# Altium schematic sheet Sheet_1_2022-06-06.schdoc
size 321 x 213 mm
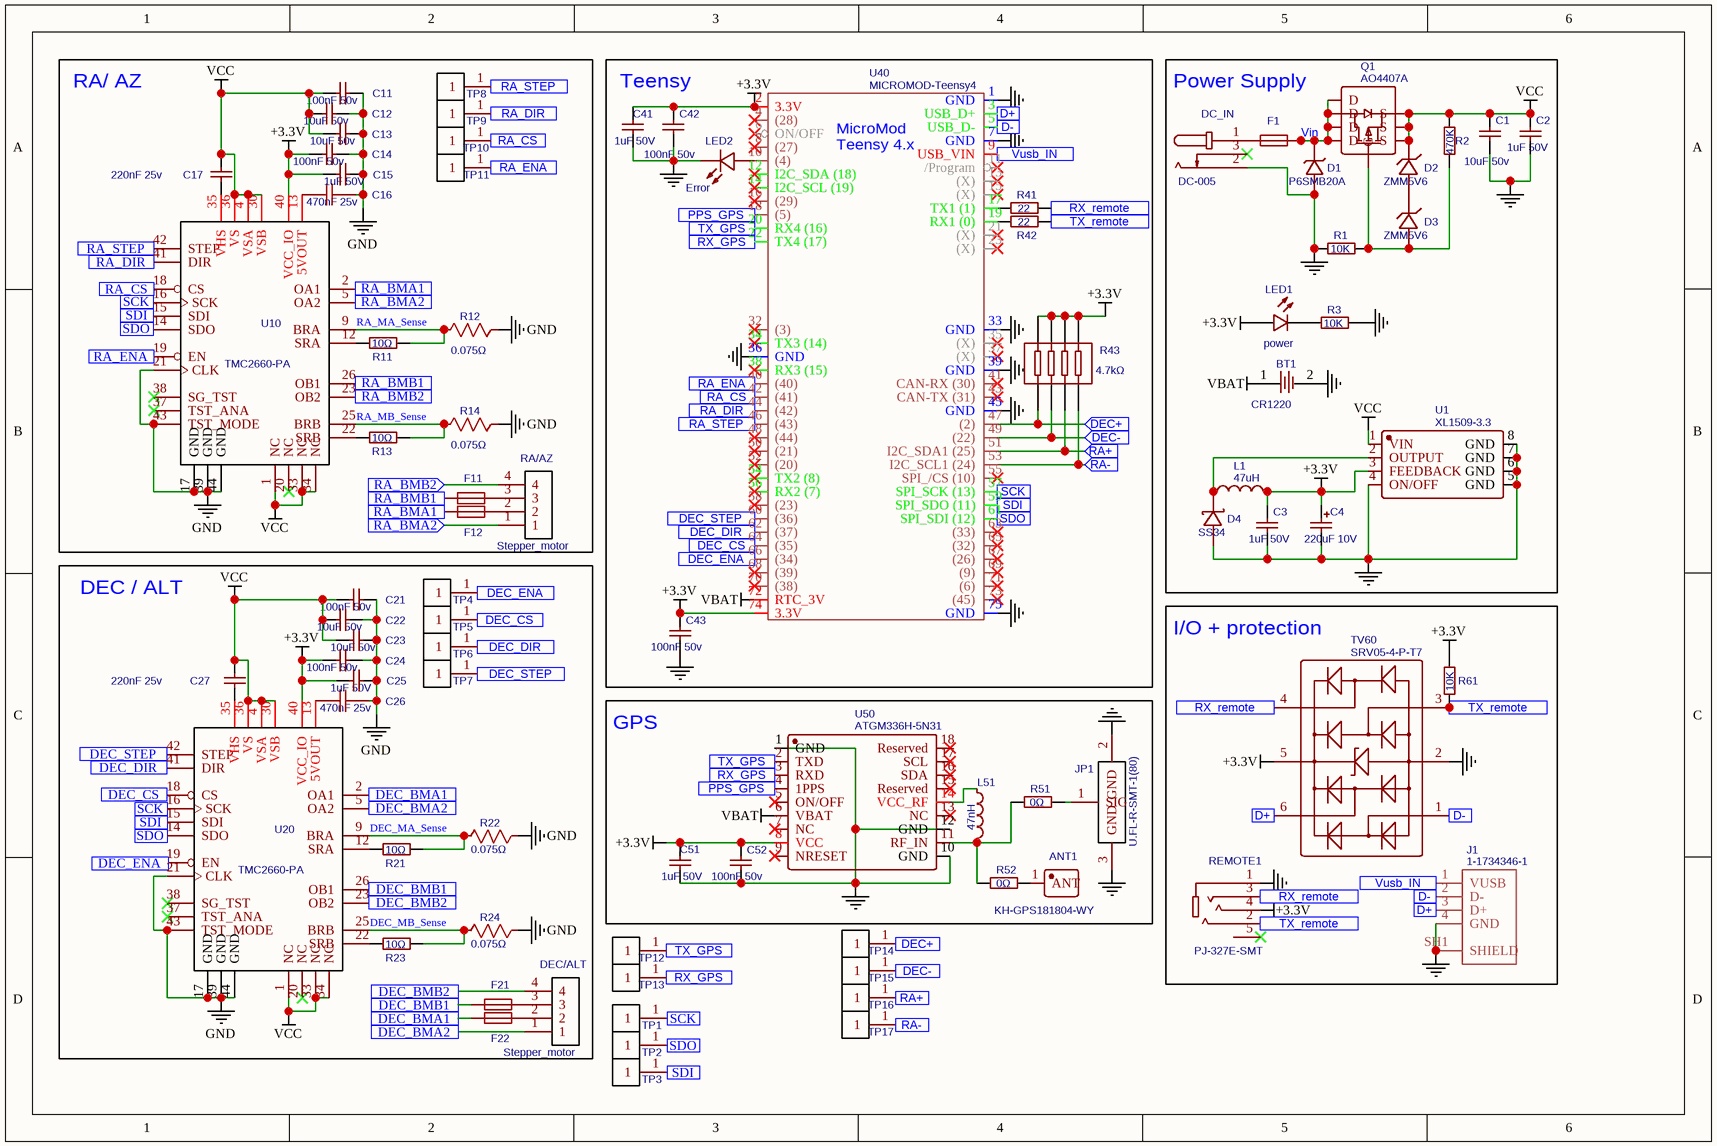
[diagram p0: Sheet_1_2022-06-06.schdoc]

## Parts
ANT1  KH-GPS181804-WY  [GPS-ANT-TH_L18.0-W18.0]
BT1  CR1220  [BAT-SMD_CR1220-2ZX]
C1  10uF 50v  [C1206]
C2  1uF 50V  [C_0603]
C3  1uF 50V  [C_0603]
C4  220uF 10V  [CAP-SMD_L7.3-W4.3-R-RD]
C11  100nF 50v  [C_0603]
C12  10uF 50v  [C1206]
C13  10uF 50v  [C1206]
C14  100nF 50v  [C_0603]
C15  1uF 50V  [C_0603]
C16  470nF 25v  [C_0603]
C17  220nF 25v  [C_0603]
C21  100nF 50v  [C_0603]
C22  10uF 50v  [C1206]
C23  10uF 50v  [C1206]
C24  100nF 50v  [C_0603]
C25  1uF 50V  [C_0603]
C26  470nF 25v  [C_0603]
C27  220nF 25v  [C_0603]
C41  1uF 50V  [C_0603]
C42  100nF 50v  [C_0603]
C43  100nF 50v  [C_0603]
C51  1uF 50V  [C_0603]
C52  100nF 50v  [C_0603]
D1  P6SMB20A  [DO-214AA_L5.6-W4.0-RD]
D2  ZMM5V6  [LL-34_L3.5-W1.5-RD]
D3  ZMM5V6  [LL-34_L3.5-W1.5-RD]
D4  SS34  [DO-214AC_L4.3-W2.7-LS5.3-RD]
DC_IN  DC-005  [DC-IN-TH_DC-005-5A-2.0-SMT]
DEC/ALT  Stepper_motor  [STEPPER_MOTOR_VERT]
F1  SMD1812P300SLR/24  [F1812]  (value not drawn)
F11  SMD1812P300SLR/24  [F1812]  (value not drawn)
F12  SMD1812P300SLR/24  [F1812]  (value not drawn)
F21  SMD1812P300SLR/24  [F1812]  (value not drawn)
F22  SMD1812P300SLR/24  [F1812]  (value not drawn)
J1  1-1734346-1  [TE_1-1734346-1]
JP1  U.FL-R-SMT-1(80)  [RF-SMD_734120114]
L1  47uH  [IND-SMD_L10.8-W10.0_SLO1040H]
L51  47nH  [L0603]
LED1  power  [LED0603-R-RD]
LED2  Error  [LED0603-R-RD]
Q1  AO4407A  [SOIC-8_L4.9-W3.9-P1.27-LS6.0-BL]
R1  10K  [R_0603]
R2  470K  [R_0603]
R3  10K  [R_0603]
R11  10Ω  [R0603]
R12  0.075Ω  [R2512]
R13  10Ω  [R0603]
R14  0.075Ω  [R2512]
R21  10Ω  [R0603]
R22  0.075Ω  [R2512]
R23  10Ω  [R0603]
R24  0.075Ω  [R2512]
R41  22  [R_0603]
R42  22  [R_0603]
R43  4.7kΩ  [RES-ARRAY-SMD_0603-8P-L3.2-W1.6-BL]
R51  0Ω  [R0603]
R52  0Ω  [R0603]
R61  10K  [R_0603]
RA/AZ  Stepper_motor  [STEPPER_MOTOR_VERT]
REMOTE1  PJ-327E-SMT  [AUDIO-SMD_PJ-327E-SMT]
TP1  test_point  [TEST_POINT]  (value not drawn)
TP2  test_point  [TEST_POINT]  (value not drawn)
TP3  test_point  [TEST_POINT]  (value not drawn)
TP4  test_point  [TEST_POINT]  (value not drawn)
TP5  test_point  [TEST_POINT]  (value not drawn)
TP6  test_point  [TEST_POINT]  (value not drawn)
TP7  test_point  [TEST_POINT]  (value not drawn)
TP8  test_point  [TEST_POINT]  (value not drawn)
TP9  test_point  [TEST_POINT]  (value not drawn)
TP10  test_point  [TEST_POINT]  (value not drawn)
TP11  test_point  [TEST_POINT]  (value not drawn)
TP12  test_point  [TEST_POINT]  (value not drawn)
TP13  test_point  [TEST_POINT]  (value not drawn)
TP14  test_point  [TEST_POINT]  (value not drawn)
TP15  test_point  [TEST_POINT]  (value not drawn)
TP16  test_point  [TEST_POINT]  (value not drawn)
TP17  test_point  [TEST_POINT]  (value not drawn)
TV60  SRV05-4-P-T7  [SOT-23-6_L2.9-W1.6-P0.95-LS2.8-BR]
U1  XL1509-3.3  [SOIC-8_L4.9-W3.9-P1.27-LS6.0-BL]
U10  TMC2660-PA  [PQFP44_WITH_PADS]
U20  TMC2660-PA  [PQFP44_WITH_PADS]
U40  MICROMOD-Teensy4  [M.2-CONNECTOR-E]
U50  ATGM336H-5N31  [GPSM-SMD_ATGM336H-TR]

## Blocks framed on the sheet
RA/ AZ: C11-C17 F11 F12 R11-R14 RA/AZ TP8-TP11 U10
Teensy: C41-C43 LED2 R41-R43 U40
Power Supply: BT1 C1-C4 D1-D4 DC_IN F1 L1 LED1 Q1 R1-R3 U1
DEC / ALT: C21-C27 DEC/ALT F21 F22 R21-R24 TP4-TP7 U20
I/O + protection: J1 R61 REMOTE1 TV60
GPS: ANT1 C51 C52 JP1 L51 R51 R52 U50

## Ports
D+ (in), D- (in), DEC+ (in), DEC- (in), DEC_BMA1 (in), DEC_BMA2 (in), DEC_BMB1 (in), DEC_BMB2 (in), DEC_CS (in), DEC_DIR (in), DEC_ENA (in), DEC_STEP (in), PPS_GPS (in), RA+ (in), RA- (in), RA_BMA1 (in), RA_BMA2 (in), RA_BMB1 (in), RA_BMB2 (in), RA_CS (in), RA_DIR (in), RA_ENA (in), RA_STEP (in), RX_GPS (in), RX_remote (in), SCK (in), SDI (in), SDO (in), TX_GPS (in), TX_remote (in), Vusb_IN (in)

## Nets
+3.3V: C3.2 C4.1 C14.1 C15.2 C24.1 C25.2 C41.2 C42.1 C43.1 C51.2 C52.1 L1.2 LED1.1(A) R43.1 R43.2 R43.3 R43.4 R61.1 REMOTE1.4 TV60.5 U1.3(FEEDBACK) U10.40(VCC_IO) U20.40(VCC_IO) U40.2(3.3V) U40.74(3.3V) U50.8(VCC)
GND: BT1.2 C1.2 C2.1 C3.1 C4.2 C11.1 C12.1 C13.1 C14.2 C15.1 C16.2 C21.1 C22.1 C23.1 C24.2 C25.1 C26.2 C41.1 C42.2 C43.2 C51.1 C52.2 D1.2 D4.2(A) DC_IN.2 J1.4(GND) J1.SH1(SHIELD) J1.SH2(SHIELD) JP1.2(GND) JP1.3(GND) LED2.2(K) R1.1 R3.1 R12.1 R14.1 R22.1 R24.1 REMOTE1.1 TV60.2 U1.4(ON/OFF) U1.5(GND) U1.6(GND) U1.7(GND) U1.8(GND) U10.17(GND) U10.21(CLK) U10.39(GND) U10.43(TST_MODE) U10.44(GND) U20.17(GND) U20.21(CLK) U20.39(GND) U20.43(TST_MODE) U20.44(GND) U40.1(GND) U40.7(GND) U40.33(GND) U40.36(GND) U40.39(GND) U40.45(GND) U40.75(GND) U50.1(GND) U50.10(GND) U50.12(GND)
VBAT: BT1.1 U40.72(RTC_3V) U50.6(VBAT)
VCC: C1.1 C2.2 C11.2 C12.2 C13.2 C17.2 C21.2 C22.2 C23.2 C27.2 D2.1(C) Q1.1(S) Q1.2(S) Q1.3(S) R2.2 U1.1(VIN) U10.1(NC) U10.4(VSA) U10.30(VSB) U10.33(NC) U10.34(NC) U10.36(VS) U20.1(NC) U20.4(VSA) U20.30(VSB) U20.33(NC) U20.34(NC) U20.36(VS)
D+: J1.3(D+) TV60.6 U40.3(USB_D+) ; port D+
D-: J1.2(D-) TV60.1 U40.5(USB_D-) ; port D-
DEC+: R43.5 TP14.1 U40.47((2)) ; port DEC+
DEC-: R43.6 TP15.1 U40.49((22)) ; port DEC-
DEC_CS: TP5.1 U40.64((35)) ; port DEC_CS
DEC_DIR: TP6.1 U40.62((37)) ; port DEC_DIR
DEC_ENA: TP4.1 U40.66((34)) ; port DEC_ENA
DEC_MA_Sense: R21.2 R22.2 U20.9(BRA)
DEC_MB_Sense: R23.2 R24.2 U20.25(BRB)
DEC_STEP: TP7.1 U40.60((36)) ; port DEC_STEP
PPS_GPS: U40.18((5)) U50.4(1PPS) ; port PPS_GPS
RA+: R43.7 TP16.1 U40.51(I2C_SDA1_(25)) ; port RA+
RA-: R43.8 TP17.1 U40.53(I2C_SCL1_(24)) ; port RA-
RA_BMA1: F12.1 ; port RA_BMA1
RA_BMA2: RA/AZ.1 ; port RA_BMA2
RA_BMB1: F11.1 ; port RA_BMB1
RA_BMB2: RA/AZ.4 ; port RA_BMB2
RA_CS: TP10.1 U10.18(CS) U40.42((41)) ; port RA_CS
RA_DIR: TP9.1 U10.41(DIR) U40.44((42)) ; port RA_DIR
RA_ENA: TP11.1 U10.19(EN) U40.40((40)) ; port RA_ENA
RA_MA_Sense: R11.2 R12.2 U10.9(BRA)
RA_MB_Sense: R13.2 R14.2 U10.25(BRB)
RA_STEP: TP8.1 U10.42(STEP) U40.46((43)) ; port RA_STEP
RX_GPS: TP13.1 U40.22(TX4_(17)) U50.3(RXD) ; port RX_GPS
RX_remote: R41.1 REMOTE1.3 TV60.4 ; port RX_remote
SCK: U20.16(SCK) U40.57(SPI_SCK_(13)) ; port SCK
SDI: U20.15(SDI) U40.59(SPI_SDO_(11)) ; port SDI
SDO: U20.14(SDO) U40.61(SPI_SDI_(12)) ; port SDO
TX_GPS: TP12.1 U40.20(RX4_(16)) U50.2(TXD) ; port TX_GPS
TX_remote: R42.1 R61.2 REMOTE1.2 TV60.3 ; port TX_remote
Vin: D1.1 F1.1 Q1.5(D) Q1.6(D) Q1.7(D) Q1.8(D)
Vusb_IN: J1.1(VUSB) U40.9(USB_VIN) ; port Vusb_IN
NetANT1_1: ANT1.1(ANT) R52.1
NetC16_1: C16.1 U10.13(5VOUT)
NetC17_1: C17.1 U10.35(VHS)
NetC26_1: C26.1 U20.13(5VOUT)
NetC27_1: C27.1 U20.35(VHS)
NetD2_2: D2.2(A) D3.1(C)
NetD3_2: D3.2(A) Q1.4(G) R1.2 R2.1
NetD4_1: D4.1(K) L1.1 U1.2(OUTPUT)
NetDC_IN_1: DC_IN.1 F1.2
NetDEC/ALT_2: DEC/ALT.2 F22.1
NetDEC/ALT_3: DEC/ALT.3 F21.1
NetF11_2: F11.2 RA/AZ.3
NetF12_2: F12.2 RA/AZ.2
NetJP1_1: JP1.1(SIG) R51.2
NetL51_1: L51.1 U50.14(VCC_RF)
NetL51_2: L51.2 R51.1 R52.2 U50.11(RF_IN)
NetLED1_2: LED1.2(C) R3.2
NetLED2_1: LED2.1(A) U40.10((4))
NetR11_1: R11.1 U10.12(SRA)
NetR13_1: R13.1 U10.22(SRB)
NetR21_1: R21.1 U20.12(SRA)
NetR23_1: R23.1 U20.22(SRB)
NetR41_2: R41.2 U40.17(TX1_(1))
NetR42_2: R42.2 U40.19(RX1_(0))

Not connected (* = marked no-connect by the designer): DC_IN 3*; DEC/ALT 1 4; F21 2; F22 2; REMOTE1 5*; TP1 1; TP2 1; TP3 1; U10 2(OA1) 5(OA2) 14(SDO) 15(SDI) 16(SCK) 20(NC)* 23(OB2) 26(OB1) 37(TST_ANA)* 38(SG_TST)*; U20 2(OA1) 5(OA2) 18(CS) 19(EN) 20(NC)* 23(OB2) 26(OB1) 37(TST_ANA)* 38(SG_TST)* 41(DIR) 42(STEP); U40 4((28))* 6(ON/OFF)* 8((27))* 11(/Program)* 12(I2C_SDA_(18))* 13((X))* 14(I2C_SCL_(19))* 15((X))* 16((29))* 21((X))* 23((X))* 32((3))* 34(TX3_(14))* 35((X))* 37((X))* 38(RX3_(15))* 41(CAN-RX_(30))* 43(CAN-TX_(31))* 48((44))* 50((21))* 52((20))* 54(TX2_(8))* 55(SPI_/CS_(10))* 56(RX2_(7))* 58((23))* 63((33))* 65((32))* 67((26))* 68((39))* 69((9))* 70((38))* 71((6))* 73((45))*; U50 5(ON/OFF)* 7(NC)* 9(NRESET)* 13(NC)* 15(Reserved)* 16(SDA)* 17(SCL)* 18(Reserved)*

## Notes on the sheet
- (in symbol MICROMOD-Teensy4) MicroMod / Teensy 4.x

## Library data of the parts
ANT1 = KH-GPS181804-WY: BOM_Manufacturer: kinghelm(金航标); Contributor: LCSC; BOM_Supplier: LCSC; BOM_Supplier Part: C962215; BOM_Manufacturer Part: KH-GPS181804-WY; spicePre: L; spiceSymbolName: KH-GPS181804-WY
BT1 = CR1220: BOM_Manufacturer: Q&J; BOM_Manufacturer Part: CR1220-2; Contributor: LCSC; BOM_Supplier: LCSC; BOM_Supplier Part: C70381; BOM_JLCPCB Part Class: Extended Part; spicePre: B; spiceSymbolName: CR1220-2ZX
C1 C12 C13 C22 C23 = 10uF 50v: BOM_Manufacturer Part: CL31A106KBHNNNE; BOM_Manufacturer: SAMSUNG; nameAlias: Capacitance; SMT Type: Basic; BOM_Supplier: LCSC; BOM_LCSC Assembly: Yes; BOM_Supplier Part: C13585; spicePre: C; spiceSymbolName: CL31A106KBHNNNE
C2 C3 C15 C25 C41 C51 = 1uF 50V: BOM_Manufacturer Part: CL10A105KB8NNNC; BOM_Manufacturer: SAMSUNG; nameAlias: Capacitance; SMT Type: Basic; BOM_Supplier: LCSC; BOM_LCSC Assembly: Yes; BOM_Supplier Part: C15849; spicePre: C; spiceSymbolName: CL10A105KB8NNNC
C4 = 220uF 10V: BOM_Manufacturer: AVX; BOM_Manufacturer Part: TAJD227K010RNJ; nameAlias: Capacitance; BOM_Supplier: LCSC; BOM_Supplier Part: C8024; BOM_JLCPCB Part Class: Extended Part; spicePre: C; spiceSymbolName: TAJD227K010RNJ
C11 C14 C21 C24 C42 C43 C52 = 100nF 50v: BOM_Manufacturer Part: CC0603KRX7R9BB104; BOM_Manufacturer: YAGEO; nameAlias: Capacitance; SMT Type: Extend; BOM_Supplier: LCSC; BOM_Supplier Part: C14663; BOM_LCSC Assembly: Yes; spicePre: C; spiceSymbolName: CL10B104JB8NNNC
C16 C26 = 470nF 25v: BOM_Manufacturer: SAMSUNG; BOM_Manufacturer Part: CL10B474KA8NNNC; nameAlias: Capacitance; Contributor: LCSC; SMT Type: Extend; BOM_Supplier: LCSC; BOM_Supplier Part: C1623; BOM_LCSC Assembly: Yes; spicePre: C; spiceSymbolName: CL10A474KB8NNNC
C17 C27 = 220nF 25v: BOM_Manufacturer Part: CL10B224KA8NNNC; BOM_Manufacturer: SAMSUNG; nameAlias: Capacitance; SMT Type: Basic; BOM_Supplier: LCSC; BOM_LCSC Assembly: Yes; BOM_Supplier Part: C21120; spicePre: C; spiceSymbolName: CL10B224KA8NNNC
D1 = P6SMB20A: BOM_Manufacturer: Yint; Contributor: LCSC; BOM_Supplier: LCSC; BOM_Supplier Part: C719321; BOM_Manufacturer Part: P6SMB20A; BOM_JLCPCB Part Class: Extended Part; spicePre: D; spiceSymbolName: P6SMB20A_C719321
D2 D3 = ZMM5V6: BOM_Manufacturer: SEMTECH; SMT Type: Basic; BOM_Supplier: LCSC; BOM_Manufacturer Part: ZMM5V6; BOM_LCSC Assembly: Yes; image: //image.lceda.cn/szlcsc/C8062.jpg; BOM_Supplier Part: C8062; spicePre: D; spiceSymbolName: ZMM5V6
D4 = SS34: BOM_Manufacturer: MDD; BOM_Supplier: LCSC; BOM_Manufacturer Part: SS34; BOM_Supplier Part: C8678; BOM_JLCPCB Part Class: Basic Part; spicePre: D; spiceSymbolName: SS34_C8678
DC_IN = DC-005: BOM_Manufacturer: XKB Enterprise; BOM_Manufacturer Part: DC-005-5A-2.0-SMT; Contributor: LCSC; BOM_Supplier: LCSC; BOM_Supplier Part: C319134; BOM_JLCPCB Part Class: Extended Part; spicePre: D; spiceSymbolName: DC-005-5A-2.0-SMT
DEC/ALT RA/AZ = Stepper_motor: BOM_Manufacturer Part: 1x4 pin header; Contributor: Ti nicO Lord Zurp; spicePre: U; spiceSymbolName: Stepper_motor
F1 F11 F12 F21 F22 = SMD1812P300SLR/24: BOM_Manufacturer: PTTC(聚鼎); SMT Type: Extend; Contributor: LCSC; BOM_Supplier: LCSC; BOM_Supplier Part: C2892380; BOM_Manufacturer Part: SMD1812P300SLR/24; BOM_LCSC Assembly: Yes; spicePre: F; spiceSymbolName: SMD1812P300SLR/24
J1 = 1-1734346-1: Contributor: eriquelmev; spicePre: J; spiceSymbolName: 1-1734346-1
JP1 = U.FL-R-SMT-1(80): BOM_Manufacturer: HRS; BOM_Supplier: LCSC; BOM_Manufacturer Part: U.FL-R-SMT-1(80); BOM_Supplier Part: C88374; BOM_JLCPCB Part Class: Extended Part; spicePre: J; spiceSymbolName: U.FL-R-SMT-1(80)
L1 = 47uH: BOM_Manufacturer: Sunltech; BOM_Manufacturer Part: SLO1040H470MTT; nameAlias: Inductance; Contributor: LCSC; BOM_Supplier: LCSC; BOM_Supplier Part: C182153; BOM_JLCPCB Part Class: Extended Part; spicePre: L; spiceSymbolName: SLO1040H470MTT
L51 = 47nH: BOM_Manufacturer: Sunlord; BOM_Manufacturer Part: SDCL1608C47NJTDF; nameAlias: Inductance; BOM_Supplier: LCSC; BOM_Supplier Part: C29683; BOM_JLCPCB Part Class: Extended Part; spicePre: L; spiceSymbolName: SDCL1608C47NJTDF
LED1 = power: BOM_Manufacturer: EVERLIGHT; BOM_Manufacturer Part: 19-217/GHC-YR1S2/3T; SMT Type: Basic; BOM_Supplier: LCSC; image: //image.lceda.cn/szlcsc/C72043.jpg; BOM_Supplier Part: C72043; BOM_JLCPCB SMD: Yes; spicePre: L; spiceSymbolName: 19-217/GHC-YR1S2/3T
LED2 = Error: BOM_Manufacturer: KENTO; BOM_Manufacturer Part: KT-0603R; BOM_Supplier: LCSC; BOM_Supplier Part: C2286; BOM_JLCPCB Part Class: Basic Part; spicePre: L; spiceSymbolName: KT-0603R
Q1 = AO4407A: BOM_Manufacturer: AOS; SMT Type: Basic; BOM_Supplier: LCSC; BOM_Manufacturer Part: AO4407A; BOM_LCSC Assembly: Yes; image: //image.lceda.cn/szlcsc/C16072.jpg; BOM_Supplier Part: C2841482; spicePre: Q; spiceSymbolName: AO4407A
R1 R3 R61 = 10K: BOM_Manufacturer: UniOhm; BOM_Manufacturer Part: 0603WAF1002T5E; nameAlias: Resistance (Ohms); SMT Type: Basic; BOM_Supplier: LCSC; BOM_LCSC Assembly: Yes; BOM_Supplier Part: C25804; spicePre: R; spiceSymbolName: 0603WAF1002T5E
R2 = 470K: BOM_Manufacturer: UniOhm; BOM_Manufacturer Part: 0603WAF4703T5E; nameAlias: Resistance (Ohms); BOM_Supplier: LCSC; BOM_Supplier Part: C23178; BOM_JLCPCB Part Class: Basic Part; spicePre: R; spiceSymbolName: 0603WAF4703T5E
R11 R13 R21 R23 = 10Ω: BOM_Manufacturer: UniOhm; BOM_Manufacturer Part: 0603WAF100JT5E; nameAlias: Resistance (Ohms); BOM_Supplier: LCSC; BOM_Supplier Part: C22859; BOM_JLCPCB Part Class: Basic Part; spicePre: R; spiceSymbolName: 0603WAF100JT5E
R12 R14 R22 R24 = 0.075Ω: BOM_Manufacturer Part: MS123WF750MT4E; BOM_Manufacturer: Uniroyal Elec; nameAlias: Value(Ω); spicePre: R; spiceSymbolName: Res_0603(1/10W)_US; BOM_Supplier: LCSC; BOM_Supplier Part: C78195
R41 R42 = 22: BOM_Manufacturer: UniOhm; BOM_Manufacturer Part: 0603WAF220JT5E; nameAlias: Resistance (Ohms); BOM_Supplier: LCSC; BOM_Supplier Part: C23345; BOM_JLCPCB Part Class: Basic Part; spicePre: R; spiceSymbolName: 0603WAF220JT5E
R43 = 4.7kΩ: BOM_Manufacturer: UniOhm; BOM_Manufacturer Part: 4D03WGJ0472T5E; nameAlias: Resistance; Resistance (Ohms): 4.7K; BOM_Supplier: LCSC; BOM_Supplier Part: C1980; BOM_JLCPCB Part Class: Basic Part; spicePre: R; spiceSymbolName: 4D03WGJ0472T5E
R51 R52 = 0Ω: BOM_Manufacturer: UniOhm; BOM_Manufacturer Part: 0603WAF0000T5E; nameAlias: Resistance; Resistance (Ohms): 0; BOM_Supplier: LCSC; BOM_Supplier Part: C21189; BOM_JLCPCB Part Class: Basic Part; spicePre: R; spiceSymbolName: 0603WAF0000T5E
REMOTE1 = PJ-327E-SMT: BOM_Manufacturer: XKB Enterprise; Contributor: LCSC; BOM_Supplier: LCSC; BOM_Supplier Part: C319105; BOM_Manufacturer Part: PJ-327E-SMT; BOM_JLCPCB Part Class: Extended Part; spicePre: A; spiceSymbolName: PJ-327E-SMT
TP1-TP17 = test_point: Contributor: lordzurp; spicePre: T; spiceSymbolName: test_point
TV60 = SRV05-4-P-T7: BOM_Manufacturer: PROTEK; BOM_Supplier: LCSC; BOM_Manufacturer Part: SRV05-4-P-T7; BOM_Supplier Part: C85364; BOM_JLCPCB Part Class: Basic Part; spicePre: T; spiceSymbolName: SRV05-4-P-T7
U1 = XL1509-3.3: BOM_Manufacturer: UMW(友台半导体); Contributor: LCSC; BOM_Supplier: LCSC; BOM_Supplier Part: C2681226; BOM_Manufacturer Part: XL1509-3.3; BOM_JLCPCB Part Class: Extended Part; spicePre: U; spiceSymbolName: XL1509-3.3
U10 U20 = TMC2660-PA: BOM_Manufacturer: TRINAMIC; BOM_Manufacturer Part: TMC2660C-PA-T; Contributor: lordzurp; BOM_Supplier: LCSC; BOM_Supplier Part: C2927052; link: https://datasheet.lcsc.com/szlcsc/1912121005_TRINAMIC-Motion-Control-GmbH-TMC2660-PA_C92654.pdf; spicePre: U; spiceSymbolName: TMC2660-PA
U40 = MICROMOD-Teensy4: BOM_Manufacturer Part: 2199230-4; BOM_Manufacturer: null; Contributor: lordzurp; BOM_Supplier Part: C9900010870; BOM_Supplier: LCSC; spicePre: T; spiceSymbolName: MICROMOD-Teensy4
U50 = ATGM336H-5N31: BOM_Manufacturer: ZHONGKEWEI; BOM_Supplier: LCSC; BOM_Manufacturer Part: ATGM336H-5N31; BOM_Supplier Part: C90770; BOM_JLCPCB Part Class: Extended Part; spicePre: U; spiceSymbolName: ATGM336H-5N31